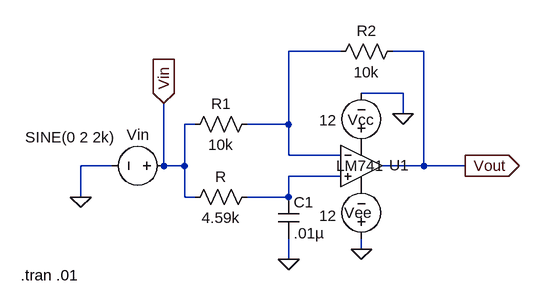
[diagram p0: schematic partA.asc]
partA.asc, the LTspice schematic file:
Version 4
SHEET 1 880 680
WIRE 144 32 64 32
WIRE 272 32 224 32
WIRE 240 96 176 96
WIRE 240 128 240 96
WIRE -80 144 -96 144
WIRE 64 144 64 32
WIRE 64 144 0 144
WIRE 64 192 64 144
WIRE 144 192 64 192
WIRE -208 208 -256 208
WIRE -128 208 -128 112
WIRE -96 208 -96 144
WIRE -96 208 -128 208
WIRE 272 208 272 32
WIRE 272 208 208 208
WIRE 336 208 272 208
WIRE 144 224 64 224
WIRE -256 256 -256 208
WIRE -96 256 -96 208
WIRE -80 256 -96 256
WIRE 64 256 64 224
WIRE 64 256 0 256
WIRE 176 336 176 320
WIRE 64 352 64 320
FLAG 64 352 0
FLAG -256 256 0
FLAG 240 128 0
FLAG 176 336 0
FLAG 336 208 Vout
IOPIN 336 208 Out
FLAG -128 112 Vin
IOPIN -128 112 In
SYMBOL LM741 176 144 R0
WINDOW 0 43 63 Left 2
WINDOW 3 -39 64 Left 2
SYMATTR InstName U1
SYMBOL res 16 128 R90
WINDOW 0 0 56 VBottom 2
WINDOW 3 32 56 VTop 2
SYMATTR InstName R1
SYMATTR Value 10k
SYMBOL res 240 16 R90
WINDOW 0 0 56 VBottom 2
WINDOW 3 32 56 VTop 2
SYMATTR InstName R2
SYMATTR Value 10k
SYMBOL res 16 240 R90
WINDOW 0 0 56 VBottom 2
WINDOW 3 32 56 VTop 2
SYMATTR InstName R
SYMATTR Value 4.59k
SYMBOL cap 48 256 R0
SYMATTR InstName C1
SYMATTR Value .01µ
SYMBOL voltage -112 208 R90
WINDOW 0 -32 56 VBottom 2
WINDOW 3 -60 160 VTop 2
WINDOW 123 0 0 Left 0
WINDOW 39 0 0 Left 0
SYMATTR InstName Vin
SYMATTR Value SINE(0 2 2k)
SYMBOL voltage 176 192 R180
WINDOW 0 -19 55 Left 2
WINDOW 3 38 54 Left 2
WINDOW 123 0 0 Left 0
WINDOW 39 0 0 Left 0
SYMATTR InstName Vcc
SYMATTR Value 12
SYMBOL voltage 176 336 R180
WINDOW 0 -16 56 Left 2
WINDOW 3 38 51 Left 2
WINDOW 123 0 0 Left 0
WINDOW 39 0 0 Left 0
SYMATTR InstName Vee
SYMATTR Value 12
TEXT -348 376 Left 2 !.tran .01

The netlist it stands for:
* partA.asc
XU1 N002 N001 P001 P002 Vout LM741  ; pins In+ In- V+ V- OUT
R1 N001 Vin 10k
R2 Vout N001 10k
R N002 Vin 4.59k
C1 N002 0 .01µ
Vin Vin 0 SINE(0 2 2k)
Vcc P001 0 12
Vee 0 P002 12
.tran .01
.lib LM741.lib
.backanno
.end